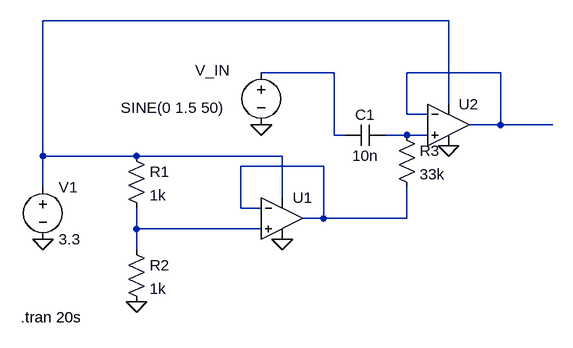
[diagram p0: schematic Display_output_circuit.asc]
Display_output_circuit.asc, the LTspice schematic file:
Version 4
SHEET 1 880 680
WIRE 256 -336 -368 -336
WIRE 80 -256 -32 -256
WIRE 336 -256 192 -256
WIRE 256 -208 256 -336
WIRE 192 -192 192 -256
WIRE 224 -192 192 -192
WIRE 336 -176 336 -256
WIRE 336 -176 288 -176
WIRE 416 -176 336 -176
WIRE 80 -160 80 -256
WIRE 96 -160 80 -160
WIRE 192 -160 160 -160
WIRE 224 -160 192 -160
WIRE -368 -128 -368 -336
WIRE -224 -128 -368 -128
WIRE 0 -128 -224 -128
WIRE 64 -112 -64 -112
WIRE -368 -80 -368 -128
WIRE 0 -64 0 -128
WIRE -64 -48 -64 -112
WIRE -32 -48 -64 -48
WIRE 64 -32 64 -112
WIRE 64 -32 32 -32
WIRE 192 -32 192 -80
WIRE 192 -32 64 -32
WIRE -224 -16 -224 -48
WIRE -32 -16 -224 -16
WIRE -224 16 -224 -16
FLAG -224 96 0
FLAG -368 0 0
FLAG 0 0 0
FLAG 256 -144 0
FLAG -32 -176 0
SYMBOL OpAmps\\UniversalOpAmp2 0 -32 R0
SYMATTR InstName U1
SYMBOL res -240 -144 R0
SYMATTR InstName R1
SYMATTR Value 1k
SYMBOL res -240 0 R0
SYMATTR InstName R2
SYMATTR Value 1k
SYMBOL voltage -368 -96 R0
WINDOW 123 0 0 Left 0
WINDOW 39 0 0 Left 0
SYMATTR InstName V1
SYMATTR Value 3.3
SYMBOL OpAmps\\UniversalOpAmp2 256 -176 R0
SYMATTR InstName U2
SYMBOL res 176 -176 R0
SYMATTR InstName R3
SYMATTR Value 33k
SYMBOL cap 160 -176 R90
WINDOW 0 0 32 VBottom 2
WINDOW 3 32 32 VTop 2
SYMATTR InstName C1
SYMATTR Value 10n
SYMBOL voltage -32 -272 R0
WINDOW 0 -102 12 Left 2
WINDOW 3 -216 70 Left 2
WINDOW 123 0 0 Left 0
WINDOW 39 0 0 Left 0
SYMATTR InstName V_IN
SYMATTR Value SINE(0 1.5 50)
TEXT -402 120 Left 2 !.tran 20s

The netlist it stands for:
* Display_output_circuit.asc
XU1 N006 N005 N001 0 N005 level2 Avol=1Meg GBW=10Meg Slew=10Meg Ilimit=25m Rail=0 Vos=0 En=0 Enk=0 In=0 Ink=0 Rin=500Meg  ; pins In+ In- V+ V- OUT
R1 N001 N006 1k
R2 N006 0 1k
V1 N001 0 3.3
XU2 N004 N003 N001 0 N003 level2 Avol=1Meg GBW=10Meg Slew=10Meg Ilimit=25m Rail=0 Vos=0 En=0 Enk=0 In=0 Ink=0 Rin=500Meg  ; pins In+ In- V+ V- OUT
R3 N004 N005 33k
C1 N004 N002 10n
V_IN N002 0 SINE(0 1.5 50)
.tran 20s
.lib UniversalOpAmp2.lib
.backanno
.end